# Altium schematic sheet NICLEO-XXXXRX.SchDoc
size A3; SheetNumber: 1; SheetTotal: 1
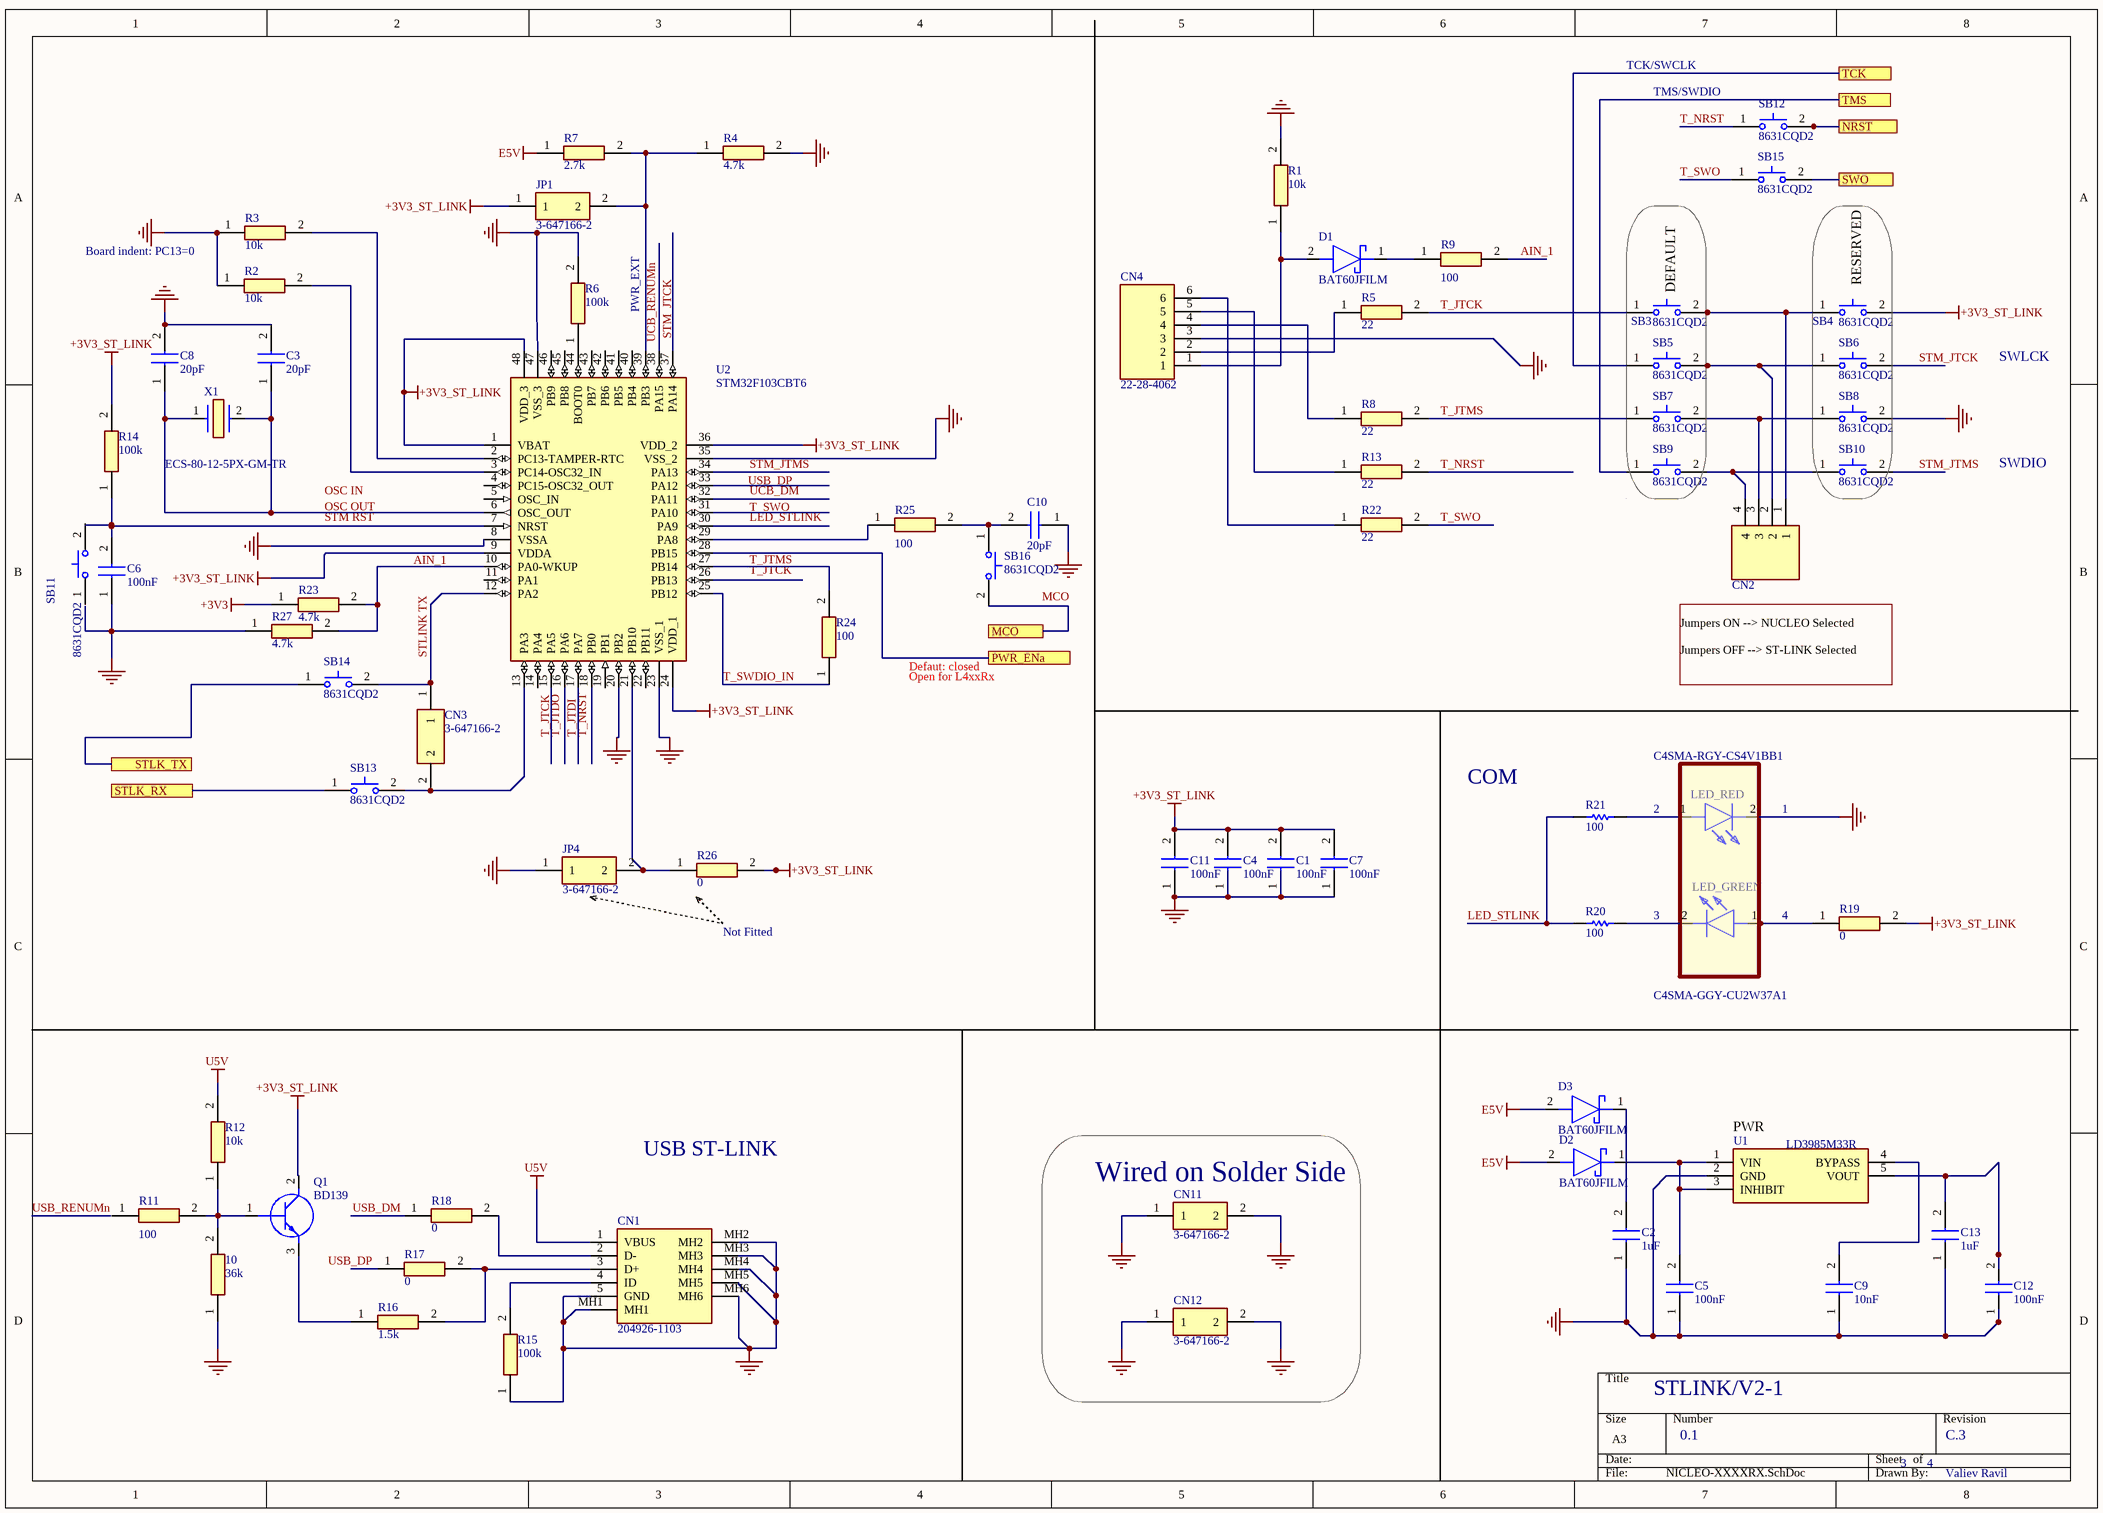
[diagram p0: NICLEO-XXXXRX.SchDoc]

## Parts
10  36k  [RESC2012X55N]
C1  100nF  [CAPC1608X90N]
C2  1uF  [MAJx16]
C3  20pF  [C1206]
C4  100nF  [CAPC1608X90N]
C5  100nF  [CAPC1608X90N]
C6  100nF  [CAPC1608X90N]
C7  100nF  [CAPC1608X90N]
C8  20pF  [C1206]
C9  10nF  [CAPC3316X145N]
C10  20pF  [C1206]
C11  100nF  [CAPC1608X90N]
C12  100nF  [CAPC1608X90N]
C13  1uF  [MAJx16]
CN1  204926-1103  [2049261103]
CN2  53014-0410  [SHDR4W60P0X200_1X4_1200X435X1000P]  (value not drawn)
CN3  3-647166-2  [36471662]
CN4  22-28-4062  [HDRV6W66P0X254_1X6_1524X249X838P]
CN11  3-647166-2  [36471662]
CN12  3-647166-2  [36471662]
D1  BAT60JFILM  [SOD2513X117N]
D2  BAT60JFILM  [SOD2513X117N]
D3  BAT60JFILM  [SOD2513X117N]
JP1  3-647166-2  [36471662]
JP4  3-647166-2  [36471662]
LED_GREEN  C4SMA-GGY-CU2W37A1  [C4SMAGGYCU2W37A1]
LED_RED  C4SMA-RGY-CS4V1BB1  [C4SMARGYCS4V1BB1]
Q1  BD139  [TO254P290X760X1320-3P]
R1  10k  [RESC3216X74N]
R2  10k  [RESC3216X74N]
R3  10k  [RESC3216X74N]
R4  4.7k  [RESC1005X37N]
R5  22  [ERA6AEB1020V]
R6  100k  [RESC1005X40N]
R7  2.7k  [RESC3225X70N]
R8  22  [ERA6AEB1020V]
R9  100  [ERA3AEB101V]
R11  100  [ERA3AEB101V]
R12  10k  [RESC3216X74N]
R13  22  [ERA6AEB1020V]
R14  100k  [RESC1005X40N]
R15  100k  [RESC1005X40N]
R16  1.5k  [RESC3116X65N]
R17  0  [RESC2013X84N]
R18  0  [RESC2013X84N]
R19  0  [RESC2013X84N]
R20  value 100  (hidden comment: Resistor)
R21  value 100  (hidden comment: Resistor)
R22  22  [ERA6AEB1020V]
R23  4.7k  [RESC1005X37N]
R24  100  [ERA3AEB101V]
R25  100  [ERA3AEB101V]
R26  0  [RESC2013X84N]
R27  4.7k  [RESC1005X37N]
SB3  8631CQD2  [8631CQD2]
SB4  8631CQD2  [8631CQD2]
SB5  8631CQD2  [8631CQD2]
SB6  8631CQD2  [8631CQD2]
SB7  8631CQD2  [8631CQD2]
SB8  8631CQD2  [8631CQD2]
SB9  8631CQD2  [8631CQD2]
SB10  8631CQD2  [8631CQD2]
SB11  8631CQD2  [8631CQD2]
SB12  8631CQD2  [8631CQD2]
SB13  8631CQD2  [8631CQD2]
SB14  8631CQD2  [8631CQD2]
SB15  8631CQD2  [8631CQD2]
SB16  8631CQD2  [8631CQD2]
U1  LD3985M33R  [SOT95P280X145-5N]
U2  STM32F103CBT6  [QFP50P900X900X160-48N]
X1  ECS-80-12-5PX-GM-TR  [ECS80125PXGMTR]

## Blocks framed on the sheet
DEFAULT: SB3 SB5 SB7 SB9
RESERVED: SB4 SB6 SB8 SB10
Wired on Solder Side: CN11 CN12

## Ports
MCO, NRST, PWR_ENa, STLK_RX, STLK_TX, SWO, TCK, TMS

## Nets
+3V3: R23.1
+3V3_ST_LINK: C1.2 C4.2 C7.2 C11.2 JP1.1 Q1.2(C) R14.2 R19.2 R26.2 SB4.2(N.O._2) U2.1(VBAT) U2.9(VDDA) U2.24(VDD_1) U2.36(VDD_2) U2.48(VDD_3)
E5V: D2.2(A) D3.2(A) R7.1
GND: 10.1 C1.1 C2.1 C3.2 C4.1 C5.1 C6.1 C7.1 C8.2 C9.1 C10.1 C11.1 C12.1 C13.1 CN1.5(GND) CN1.MH1 CN1.MH2 CN1.MH3 CN1.MH4 CN1.MH5 CN1.MH6 CN4.3 CN11.1 CN11.2 CN12.1 CN12.2 JP4.1 LED_RED.2(K) R1.2 R2.1 R3.1 R4.2 R6.2 R15.1 R27.1 SB8.2(N.O._2) U1.2(GND) U2.8(VSSA) U2.20(PB2) U2.23(VSS_1) U2.35(VSS_2) U2.47(VSS_3)
U5V: CN1.1(VBUS) R12.2
MCO: SB16.2(N.O._2) ; port MCO
NRST: SB12.2(N.O._2) ; port NRST
PWR_ENa: U2.28(PB15) ; port PWR_ENa
STLK_RX: SB13.1(N.O._1) ; port STLK_RX
STLK_TX: SB14.1(N.O._1) ; port STLK_TX
SWO: SB15.2(N.O._2) ; port SWO
TCK: SB5.1(N.O._1) ; port TCK
TMS: SB9.1(N.O._1) ; port TMS
Net10_2: 10.2 Q1.1(B) R11.2 R12.1
NetC2_2: C2.2 D3.1(K)
NetC3_1: C3.1 C8.1 U2.6(OSC_OUT) X1.1 X1.2
NetC5_2: C5.2 D2.1(K) U1.1(VIN) U1.3(INHIBIT)
NetC6_2: C6.2 R14.1 U2.7(NRST)
NetC9_2: C9.2 U1.4(BYPASS)
NetC10_2: C10.2 R25.2 SB16.1(N.O._1)
NetC12_2: C12.2 C13.2 U1.5(VOUT)
NetCN1_2: CN1.2(D-) R18.2
NetCN1_3: CN1.3(D+) R16.2 R17.2
NetCN1_4: CN1.4(ID) R15.2
NetCN2_1: CN2.1 SB3.2(N.O._2) SB4.1(N.O._1)
NetCN2_2: CN2.2 SB5.2(N.O._2) SB6.1(N.O._1)
NetCN2_3: CN2.3 SB7.2(N.O._2) SB8.1(N.O._1)
NetCN2_4: CN2.4 SB9.2(N.O._2) SB10.1(N.O._1)
NetCN3_1: CN3.1 SB14.2(N.O._2) U2.12(PA2)
NetCN3_2: CN3.2 SB13.2(N.O._2) U2.13(PA3)
NetCN4_1: CN4.1 D1.2(A) R1.1
NetCN4_2: CN4.2 R5.1
NetCN4_4: CN4.4 R8.1
NetCN4_5: CN4.5 R13.1
NetCN4_6: CN4.6 R22.1
NetD1_1: D1.1(K) R9.1
NetJP1_2: JP1.2 R4.1 R7.2 U2.39(PB3)
NetJP4_2: JP4.2 R26.1 U2.21(PB10)
NetLED_GREEN_1: LED_GREEN.1(A) R19.1
NetLED_GREEN_2: LED_GREEN.2(K) R20.2
NetLED_RED_1: LED_RED.1(A) R21.2
NetQ1_3: Q1.3(E) R16.1
NetR2_2: R2.2 U2.3(PC14-OSC32_IN)
NetR3_2: R3.2 U2.2(PC13-TAMPER-RTC)
NetR5_2: R5.2 SB3.1(N.O._1)
NetR6_1: R6.1 U2.44(BOOT0)
NetR8_2: R8.2 SB7.1(N.O._1)
NetR20_1: R20.1 R21.1
NetR23_2: R23.2 R27.2 U2.10(PA0-WKUP)
NetR24_1: R24.1 U2.25(PB12)
NetR24_2: R24.2 U2.27(PB14)
NetR25_1: R25.1 U2.29(PA8)

Not connected (* = marked no-connect by the designer): R9 2; R11 1; R13 2; R17 1; R18 1; R22 2; SB6 2(N.O._2); SB10 2(N.O._2); SB11 1(N.O._1) 2(N.O._2); SB12 1(N.O._1); SB15 1(N.O._1); U2 4(PC15-OSC32_OUT) 5(OSC_IN) 11(PA1) 14(PA4) 15(PA5) 16(PA6) 17(PA7) 18(PB0) 19(PB1) 22(PB11) 26(PB13) 30(PA9) 31(PA10) 32(PA11) 33(PA12) 34(PA13) 37(PA14) 38(PA15) 40(PB4) 41(PB5) 42(PB6) 43(PB7) 45(PB8) 46(PB9)

## Notes on the sheet
- TCK/SWCLK
- TMS/SWDIO
- T_NRST
- T_SWO
- Board indent: PC13=0
- (near R9) AIN_1
- PWR_EXT
- UCB_RENUMn
- T_JTCK
- (near U2) STM_JTCK
- STM_JTCK
- SWLCK
- (near R8) T_JTMS
- OSC IN
- OSC OUT
- STM RST
- STM_JTMS
- UCB_DM
- LED_STLINK
- USB_DP
- SWDIO
- AIN_1
- T_JTMS
- STLINK TX
- Defaut: closed
- MCO
- Jumpers ON --> NUCLEO Selected
- Jumpers OFF --> ST-LINK Selected
- T_SWDIO_IN
- Open for L4xxRx
- (near U2) T_JTCK
- (near U2) T_JTDO
- (near U2) T_JTDI
- (near U2) T_NRST
- COM
- 2
- (near LED_RED) 1
- (near R26) Not Fitted
- 3
- 4
- (near U1) PWR
- USB ST-LINK
- (near R11) USB_RENUMn
- USB_DM
- STLINK/V2-1
- 0.1
- C.3
- Valiev Ravil

## Library data of the parts
10 = TNPW080536K0BEEA: Resistor; Manufacturer_Name: Vishay; Datasheet Link: https://www.vishay.com/docs/31006/tnpw.pdf; Height: 0.55mm; Manufacturer_Part_Number: TNPW080536K0BEEA
C1 C4-C7 C11 C12 = 06035C104K4T4A: Capacitor; Manufacturer_Name: Kyocera AVX; Datasheet Link: https://componentsearchengine.com/Datasheets/1/06031A100FAT2A.pdf; Height: 100nF; Manufacturer_Part_Number: 06035C104K4T4A; Mouser Part Number: 581-06035C104K4T4A; Mouser Price/Stock: https://www.mouser.co.uk/ProductDetail/KYOCERA-AVX/06035C104K4T4A?qs=NBj5Hwer2CEXBYKT%252BbuSBA%3D%3D; Arrow Part Number: 06035C104K4T4A; Arrow Price/Stock: https://www.arrow.com/en/products/06035c104k4t4a/avx
C2 C13 = MAJCT168BB7105KTEA01: Capacitor; Manufacturer_Name: TAIYO YUDEN; Datasheet Link: https://ds.yuden.co.jp/TYCOMPAS/or/detail?pn=MAJCT168BB7105KTEA01; Height: 0.8mm; Manufacturer_Part_Number: MAJCT168BB7105KTEA01
C3 C8 C10 = C1206C200KCGACTU: Capacitor; Manufacturer_Name: KEMET; Datasheet Link: https://content.kemet.com/datasheets/KEM_C1009_C0G_HV_SMD.pdf; Manufacturer_Part_Number: C1206C200KCGACTU
C9 = KGM31GCG2J103JU: Capacitor; Manufacturer_Name: Kyocera AVX; Datasheet Link: https://datasheets.kyocera-avx.com/HVKGM.pdf; Height: 1.45mm; Manufacturer_Part_Number: KGM31GCG2J103JU; Mouser Part Number: 581-KGM31GCG2J103JU; Mouser Price/Stock: https://www.mouser.co.uk/ProductDetail/KYOCERA-AVX/KGM31GCG2J103JU?qs=63Lh8XYXgjt6ivbLeGkCxg%3D%3D
CN1 = 204926-1103: Connector; Manufacturer_Name: Molex; Datasheet Link: https://www.molex.com/content/dam/molex/molex-dot-com/products/automated/en-us/salesdrawingpdf/204/204926/2049261103_sd.pdf; Height: 4.65mm; Manufacturer_Part_Number: 204926-1103; Mouser Part Number: 538-204926-1103; Mouser Price/Stock: https://www.mouser.co.uk/ProductDetail/Molex/204926-1103?qs=55YtniHzbhBOQihiQOeiLg%3D%3D; Arrow Part Number: 204926-1103; Arrow Price/Stock: https://www.arrow.com/en/products/204926-1103/molex?region=nac
CN2 = 53014-0410: Connector; Manufacturer_Name: Molex; Datasheet Link: https://www.molex.com/pdm_docs/sd/530140410_sd.pdf; Height: 10mm; Manufacturer_Part_Number: 53014-0410; Mouser Part Number: 538-53014-0410; Mouser Price/Stock: https://www.mouser.co.uk/ProductDetail/Molex/53014-0410?qs=TLs3Kb%252BkMqKk8s1WRHwRGw%3D%3D
CN3 CN11 CN12 JP1 JP4 = 3-647166-2: Connector; Manufacturer_Name: TE Connectivity; Datasheet Link: https://www.te.com/commerce/DocumentDelivery/DDEController?Action=showdoc&DocId=Customer+Drawing%7F647166%7FR1%7Fpdf%7FEnglish%7FENG_CD_647166_R1.pdf%7F3-647166-2; Height: 10.66mm; Manufacturer_Part_Number: 3-647166-2; Mouser Part Number: 571-3-647166-2; Mouser Price/Stock: https://www.mouser.co.uk/ProductDetail/TE-Connectivity/3-647166-2?qs=xsTFCgGnzbJU1qz6Np9kzA%3D%3D; Arrow Part Number: 3-647166-2; Arrow Price/Stock: https://www.arrow.com/en/products/3-647166-2/te-connectivity?region=nac
CN4 = 22-28-4062: Connector; Manufacturer_Name: Molex; Datasheet Link: https://datasheet.datasheetarchive.com/originals/distributors/SFDatasheet-1/sf-00031037.pdf; Height: 8.38mm; Manufacturer_Part_Number: 22-28-4062; Mouser Part Number: 538-22-28-4062; Mouser Price/Stock: https://www.mouser.com/Search/Refine.aspx?Keyword=538-22-28-4062
D1-D3 = BAT60JFILM: Schottky Diode; Manufacturer_Name: STMicroelectronics; Datasheet Link: https://www.mouser.jp/datasheet/2/389/cd00001944-1795661.pdf; Height: 1.17mm; Manufacturer_Part_Number: BAT60JFILM; Mouser Part Number: 511-BAT60JFILM; Mouser Price/Stock: https://www.mouser.co.uk/ProductDetail/STMicroelectronics/BAT60JFILM?qs=GnFZssByvVVVnMaukcyLZg%3D%3D; Arrow Part Number: BAT60JFILM; Arrow Price/Stock: https://www.arrow.com/en/products/bat60jfilm/stmicroelectronics?region=nac
LED_GREEN = C4SMA-GGY-CU2W37A1: LED; Manufacturer_Name: CREE LED; Datasheet Link: https://cree-led.com/media/documents/C4SMA-1442.pdf; Height: 8.8mm; Manufacturer_Part_Number: C4SMA-GGY-CU2W37A1; Mouser Part Number: 941-C4SMAGGYCU2W37A1; Mouser Price/Stock: https://www.mouser.co.uk/ProductDetail/Cree-LED/C4SMA-GGY-CU2W37A1?qs=7D1LtPJG0i1gnYL5Rh9Mjg%3D%3D
LED_RED = C4SMA-RGY-CS4V1BB1: LED; Manufacturer_Name: CREE LED; Datasheet Link: https://cree-led.com/media/documents/C4SMA-1442.pdf; Height: 8.8mm; Manufacturer_Part_Number: C4SMA-RGY-CS4V1BB1; Mouser Part Number: 941-C4SMARGYCS4V1BB1; Mouser Price/Stock: https://www.mouser.co.uk/ProductDetail/Cree-LED/C4SMA-RGY-CS4V1BB1?qs=7D1LtPJG0i08%2Fw1qRIcnyw%3D%3D; Arrow Part Number: C4SMA-RGY-CS4V1BB1; Arrow Price/Stock: https://www.arrow.com/en/products/c4sma-rgy-cs4v1bb1/cree-led?region=nac
Q1 = BD139: Transistor BJT NPN; Manufacturer_Name: STMicroelectronics; Datasheet Link: http://www.st.com/web/en/resource/technical/document/datasheet/CD00001225.pdf; Height: 2.9mm; Manufacturer_Part_Number: BD139; Mouser Part Number: 511-BD139; Mouser Price/Stock: https://www.mouser.co.uk/ProductDetail/STMicroelectronics/BD139?qs=ljbEvF4DwOPW%2FLxHSWYMMA%3D%3D; Arrow Part Number: BD139; Arrow Price/Stock: https://www.arrow.com/en/products/bd139/stmicroelectronics?region=europe
R1-R3 R12 = CRMV1206AF10K0FKE5: Resistor; Manufacturer_Name: Vishay; Datasheet Link: https://www.vishay.com/docs/68037/crmv.pdf; Height: 0.74mm; Manufacturer_Part_Number: CRMV1206AF10K0FKE5; Mouser Part Number: 71-RMV1206AF10K0FKE5; Mouser Price/Stock: https://www.mouser.co.uk/ProductDetail/Vishay-Techno/CRMV1206AF10K0FKE5?qs=l8RvIzyJx4lLA%2F4RSSc%2F9A%3D%3D
R4 R23 R27 = MCS04020D4701BE000: Resistor; Manufacturer_Name: Vishay; Datasheet Link: http://www.vishay.com/docs/28705/mcx0x0xpro.pdf; Height: 0.37mm; Manufacturer_Part_Number: MCS04020D4701BE000; Mouser Part Number: 594-MCS04020D4701BE0; Mouser Price/Stock: https://www.mouser.co.uk/ProductDetail/Vishay-Beyschlag/MCS04020D4701BE000?qs=ft9OtscSA3%252BR0DpF5QqL2Q%3D%3D
R5 R8 R13 R22 = ERA-6AHD220V: Resistor; Manufacturer_Name: Panasonic; Datasheet Link: https://industrial.panasonic.com/cdbs/www-data/pdf/RDM0000/AOA0000C307.pdf; Height: 0.6mm; Manufacturer_Part_Number: ERA-6AHD220V; Mouser Part Number: 667-ERA-6AHD220V; Mouser Price/Stock: https://www.mouser.co.uk/ProductDetail/Panasonic/ERA-6AHD220V/?qs=MNPzkKEzRtQTWqg2JSKn2A%3D%3D
R6 R14 R15 = SFR01MZPF1003: Resistor; Manufacturer_Name: ROHM Semiconductor; Datasheet Link: https://fscdn.rohm.com/en/products/databook/datasheet/passive/resistor/chip_resistor/sfr-e.pdf; Height: 0.4mm; Manufacturer_Part_Number: SFR01MZPF1003; Mouser Part Number: 755-SFR01MZPF1003; Mouser Price/Stock: https://www.mouser.co.uk/ProductDetail/ROHM-Semiconductor/SFR01MZPF1003?qs=Mv7BduZupUj2RFL5gMaKTg%3D%3D
R7 = CRCW12102K70FKEAHP: Resistor; Manufacturer_Name: Vishay; Datasheet Link: http://componentsearchengine.com/Datasheets/1/CRCW12102K70FKEAHP.pdf; Height: 0.7mm; Manufacturer_Part_Number: CRCW12102K70FKEAHP; Mouser Part Number: 71-CRCW12102K70FKEAH; Mouser Price/Stock: https://www.mouser.co.uk/ProductDetail/Vishay-Dale/CRCW12102K70FKEAHP?qs=OAzHGkhREL0m0%252BU1n6AaAg%3D%3D
R9 R11 R24 R25 = ERA-3AED101V: Resistor; Manufacturer_Name: Panasonic; Datasheet Link: https://industrial.panasonic.com/cdbs/www-data/pdf/RDM0000/AOA0000C307.pdf; Height: 0.55mm; Manufacturer_Part_Number: ERA-3AED101V; Mouser Part Number: 667-ERA-3AED101V; Mouser Price/Stock: https://www.mouser.co.uk/ProductDetail/Panasonic/ERA-3AED101V?qs=MNPzkKEzRtTdzGewEn1kig%3D%3D; Arrow Part Number: ERA-3AED101V; Arrow Price/Stock: https://www.arrow.com/en/products/era-3aed101v/panasonic
R16 = CRCW12061K50FKEAHP: Resistor; Manufacturer_Name: Vishay; Datasheet Link: http://componentsearchengine.com/Datasheets/1/CRCW12061K50FKEAHP.pdf; Height: 0.65mm; Manufacturer_Part_Number: CRCW12061K50FKEAHP; Mouser Part Number: 71-CRCW12061K50FKEAH; Mouser Price/Stock: https://www.mouser.co.uk/ProductDetail/Vishay-Dale/CRCW12061K50FKEAHP?qs=k2%2FDWSARqgEwHXAQbL4aEg%3D%3D; Arrow Part Number: CRCW12061K50FKEAHP; Arrow Price/Stock: https://www.arrow.com/en/products/crcw12061k50fkeahp/vishay?region=nac
R17-R19 R26 = WSL080500000ZEA9: Resistor; Manufacturer_Name: Vishay; Datasheet Link: https://ad.componentsearchengine.com/Datasheets/2/WSL080500000ZEA9.pdf; Height: 0.838mm; Manufacturer_Part_Number: WSL080500000ZEA9; Mouser Part Number: 71-WSL080500000ZEA9; Mouser Price/Stock: https://www.mouser.co.uk/ProductDetail/Vishay-Dale/WSL080500000ZEA9?qs=f1l5vAGoKgsImKS87N8TmQ%3D%3D; Arrow Part Number: WSL080500000ZEA9; Arrow Price/Stock: https://www.arrow.com/en/products/wsl080500000zea9/vishay?region=nac
R20 R21 = Resistor: TC1: 0; SimulationGenericComponent: True; TC2: 0
SB3-SB16 = 8631CQD2: Switch (2-Pin Push); Manufacturer_Name: C & K COMPONENTS; Datasheet Link: https://www.ckswitches.com/media/1396/8600.pdf; Height: 13.93mm; Manufacturer_Part_Number: 8631CQD2; Mouser Part Number: 611-8631-261; Mouser Price/Stock: https://www.mouser.co.uk/ProductDetail/CK/8631CQD2?qs=ktcBc77oICXe9iPhfEwnkA%3D%3D
U1 = LD3985M33R: Integrated Circuit; Manufacturer_Name: STMicroelectronics; Datasheet Link: http://www.st.com/st-web-ui/static/active/en/resource/technical/document/datasheet/CD00003395.pdf; Height: 1.45mm; Manufacturer_Part_Number: LD3985M33R; Mouser Part Number: 511-LD3985M33R; Mouser Price/Stock: https://www.mouser.co.uk/ProductDetail/STMicroelectronics/LD3985M33R?qs=22WmWNTp1rrPOccVv4HZ7A%3D%3D; Arrow Part Number: LD3985M33R; Arrow Price/Stock: https://www.arrow.com/en/products/ld3985m33r/stmicroelectronics?region=europe
U2 = STM32F103CBT6: Integrated Circuit; Manufacturer_Name: STMicroelectronics; Datasheet Link: http://www.st.com/st-web-ui/static/active/en/resource/technical/document/datasheet/CD00161566.pdf; Height: 1.6mm; Manufacturer_Part_Number: STM32F103CBT6; Mouser Part Number: 511-STM32F103CBT6; Mouser Price/Stock: https://www.mouser.co.uk/ProductDetail/STMicroelectronics/STM32F103CBT6?qs=WxFF5lh7QM3goh6GV5Ogig%3D%3D; Arrow Part Number: STM32F103CBT6; Arrow Price/Stock: https://www.arrow.com/en/products/stm32f103cbt6/stmicroelectronics?region=europe
X1 = ECS-80-12-5PX-GM-TR: Crystal or Oscillator; Manufacturer_Name: ECS; Datasheet Link: https://ecsxtal.com/store/pdf/csm-7x.pdf; Height: 4.3mm; Manufacturer_Part_Number: ECS-80-12-5PX-GM-TR; Mouser Part Number: 520-80-12-5PX-GM-TR; Mouser Price/Stock: https://www.mouser.co.uk/ProductDetail/ECS/ECS-80-12-5PX-GM-TR?qs=amGC7iS6iy%252BwzUdIY7WpOA%3D%3D